# EAGLE schematic EEZ PSU power board r5B6b (EAGLE 6.1)
Assembly variants: Farnell, TME

## Sheet 1 of 5
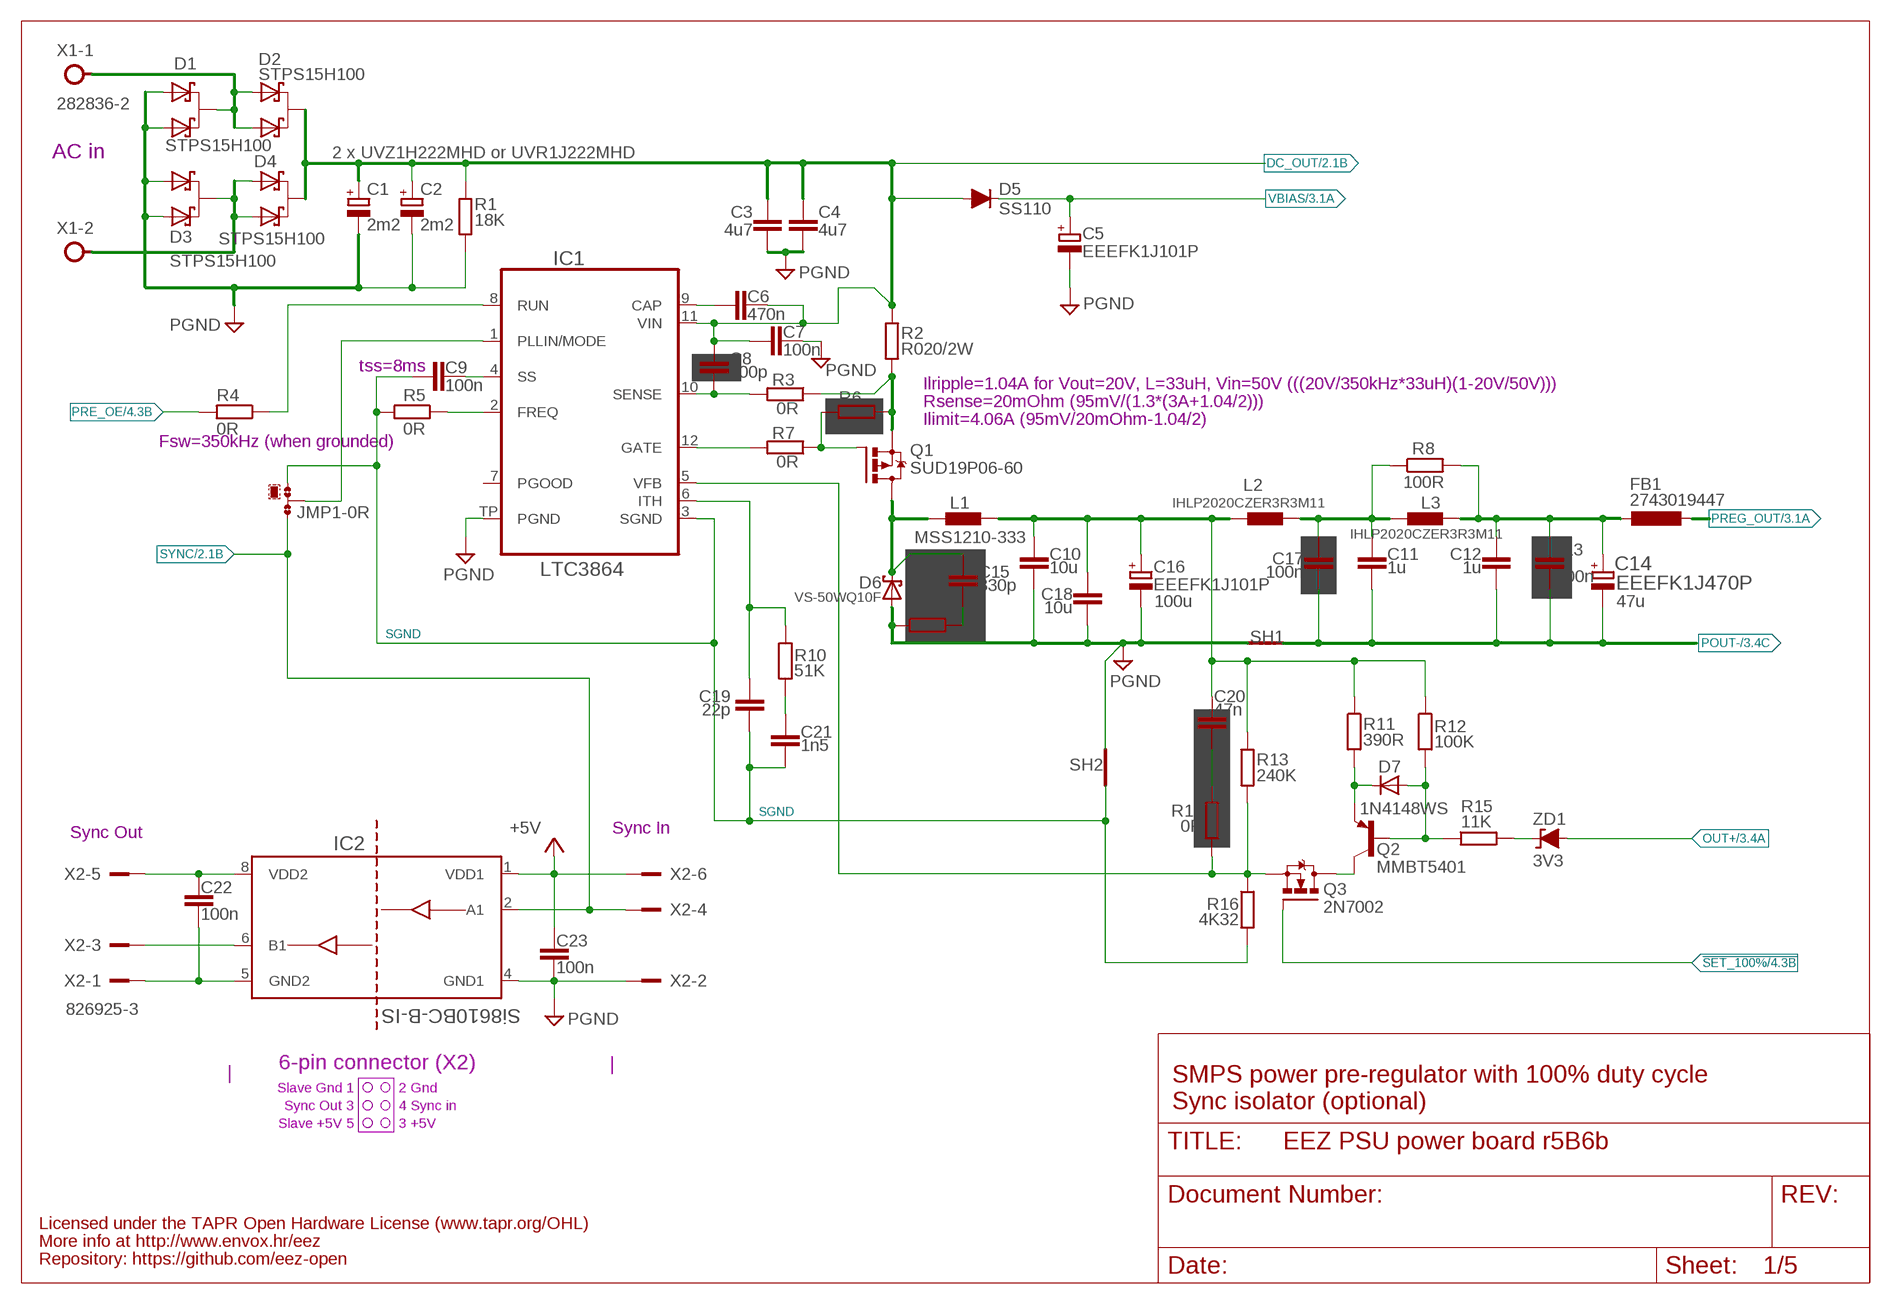
[diagram p0: schematic, sheet 1]

### Parts
C1  2m2  ECAP7.5G_18MM  [ECAP7.5/18]
C2  2m2  ECAP7.5G_18MM  [ECAP7.5/18]
C3  4u7  C-EUC1210  [C1210]
C4  4u7  C-EUC1210  [C1210]
C5  EEEFK1J101P  ECAP5G_10.5MM_F  [ECAP5/10.5+PANASONIC_F]
C6  470n  C-EUC0805  [C0805]
C7  100n  C-EUC0805  [C0805]
C8  100p  C-EUC0805  [C0805]
C9  100n  C-EUC0805  [C0805]
C10  10u  C-EUC1210  [C1210]
C11  1u  C-EUC1206  [C1206]
C12  1u  C-EUC1206  [C1206]
C13  100n  C-EUC0805  [C0805]
C14  EEEFK1J470P  EEE-FK1J470P-CASE-F  [CAPAE830X1050N]
C15  330p  C-EUC0805  [C0805]
C16  EEEFK1J101P  ECAP5G_10.5MM_F  [ECAP5/10.5+PANASONIC_F]
C17  100n  C-EUC0805  [C0805]
C18  10u  C-EUC1210  [C1210]
C19  22p  C-EUC0805  [C0805]
C20  47n  C-EUC0805  [C0805]
C21  1n5  C-EUC0805  [C0805]
C22  100n  C-EUC0603  [C0603]
C23  100n  C-EUC0603  [C0603]
D1  STPS15H100  VS-6CWQ06FNPBF  [TO252@1]
D2  STPS15H100  VS-6CWQ06FNPBF  [TO252@1]
D3  STPS15H100  VS-6CWQ06FNPBF  [TO252@1]
D4  STPS15H100  VS-6CWQ06FNPBF  [TO252@1]
D5  SS110  DIODEDO214AA  [DO214AA]
D6  VS-50WQ10F  SCHOTTKYTO252  [TO252@1]
D7  1N4148WS  DIODE-SOD323-W  [SOD323-W]
FB1  2743019447  L-EUL1812  [L1812]
IC1  LTC3864  [LTC_05-08-1666]
IC2  Si8610BC-B-IS  SI8610  [SOIC127P600X173-8N]
JMP1  0R-JUMPA  [A0R-JMP]
L1  MSS1210-333  COILCRAFT_MSS1210  [MSS1210]
L2  IHLP2020CZER3R3M11  IHLP-2020BZ-11  [IHLP-2020BZ-11]
L3  IHLP2020CZER3R3M11  IHLP-2020BZ-11  [IHLP-2020BZ-11]
Q1  SUD19P06-60  P-MOSFETDPAK  [TO229P990X239-3N]
Q2  MMBT5401  BC857B-PNP-SOT23-BEC  [SOT23-BEC]
Q3  2N7002  [SOT103P240X110-3N]
R1  18K  R-EU_R1206  [R1206]
R2  R020/2W  R-EU_R2512  [R2512]
R3  0R  R-EU_R0805  [R0805]
R4  0R  R-EU_R0805  [R0805]
R5  0R  R-EU_R0805  [R0805]
R6  100K  R-EU_R0805  [R0805]
R7  0R  R-EU_R0805  [R0805]
R8  100R  R-EU_R0805  [R0805]
R9  10R  R-EU_R1206  [R1206]
R10  51K  R-EU_R0805  [R0805]
R11  390R  R-EU_R0805  [R0805]
R12  100K  R-EU_R0805  [R0805]
R13  240K  R-EU_R0805  [R0805]
R14  0R  R-EU_R0805  [R0805]
R15  11K  R-EU_R0805  [R0805]
R16  4K32  R-EU_R0805  [R0805]
SH1  Pgnd to Pout- short  SHORT  [SHORT]
SH2  Sgnd to Pgnd short  SHORT  [SHORT]
X1  282836-2  TBLOCK5.0_2A  [TBLOCK5.0_2]
X2  826925-3  TSW-103-07-F-D  [TSW-103-07-F-D]
ZD1  3V3  ZENER-DIODEMINIMELF  [MINIMELF]

### Nets
!SET_100%: Q3.1(G) ; also sheet 4
+5V: C23.1 IC2.1(VDD1) X2.6 ; also sheet 2,3,4,5
AC_IN1: D3.3(C) D4.1(A1) D4.2(A2) X1.2
AC_IN2: D1.3(C) D2.1(A1) D2.2(A2) X1.1
DC_OUT: C1.+ C2.+ C3.1 C4.1 C6.2 C7.1 C8.1 D2.3(C) D4.3(C) D5.A IC1.11(VIN) R1.1 R2.1 ; also sheet 2
FB: IC1.5(VFB) Q3.2(S) R13.2 R14.1 R16.1
GND [gnd]: C1.- C2.- C3.2 C4.2 C5.- C5.-.1(-) C7.2 C10.2 C16.- C16.-.1(-) C18.2 C23.2 D1.1(A1) D1.2(A2) D3.1(A1) D3.2(A2) D6.1(A) D6.2(A) IC1.TP(PGND) IC2.4(GND1) R1.2 R9.1 SH1.2(GND_B) SH2.2(GND_B) X2.2 ; supply symbol labelled PGND ; also sheet 2,3,4,5
ISO_GND: C22.2 IC2.5(GND2) X2.1
L_OUT: C10.1 C16.+ C16.+.1(+) C18.1 C20.1 L1.2 L2.1 R11.1 R12.1 R13.1
MODE: IC1.1(PLLIN/MODE) JMP1.2
N$7: C20.2 R14.2
N$19: D7.C Q2.E R11.2
N$20: C19.1 IC1.6(ITH) R10.2
N$21: C21.1 R10.1
N$23: C6.1 IC1.9(CAP)
N$24: C8.2 IC1.10(SENSE) R3.2
N$25: R15.2 ZD1.C
N$28: IC1.12(GATE) R7.2
N$30: Q1.1(G) R6.1 R7.1
N$31: IC1.2(FREQ) R5.1
N$33: C9.2 IC1.4(SS)
N$34: Q2.C Q3.3(D)
N$35: C11.1 C17.2 L2.2 L3.1 R8.1
N$36: IC1.8(RUN) R4.1
N$38: C15.2 R9.2
N$79: D7.A Q2.B R12.2 R15.1
N$127: IC2.6(B1) X2.3
N$193: C22.1 IC2.8(VDD2) X2.5
OUT+: ZD1.A ; also sheet 3
P_OUT: C12.1 C13.1 C14.1 FB1.1 L3.2 R8.2
POUT-: C11.2 C12.2 C13.2 C14.2 C17.1 SH1.1(GND_A) ; also sheet 3
PRE_OE: R4.2 ; also sheet 4
PREG_OUT: FB1.2 ; also sheet 3
SENSE: Q1.3(S) R2.2 R3.1 R6.2
SGND: C9.1 C19.2 C21.2 IC1.3(SGND) JMP1.1 R5.2 R16.2 SH2.1(GND_A)
SW: C15.1 D6.3(C) L1.1 Q1.2(D)
SYNC: IC2.2(A1) JMP1.3 X2.4 ; also sheet 2
VBIAS: C5.+ C5.+.1(+) D5.C ; also sheet 3
Unconnected: IC1.7(PGOOD)

### Notes on the sheet
- AC in | 2 x UVZ1H222MHD or UVR1J222MHD
- tss=8ms
- Ilripple=1.04A for Vout=20V, L=33uH, Vin=50V (((20V/350kHz*33uH)(1-20V/50V)))
- Rsense=20mOhm (95mV/(1.3*(3A+1.04/2)))
- Ilimit=4.06A (95mV/20mOhm-1.04/2)
- Fsw=350kHz (when grounded)
- 100u | 47u
- Sync Out | Sync In
- 6-pin connector (X2)
- Slave Gnd 1 | 2 Gnd | SMPS power pre-regulator with 100% duty cycle
- Sync Out 3 | 4 Sync in
- Sync isolator (optional)
- Slave +5V 5 | 3 +5V
- Licensed under the TAPR Open Hardware License (www.tapr.org/OHL)
- More info at http://www.envox.hr/eez
- Repository: https://github.com/eez-open

## Sheet 2 of 5
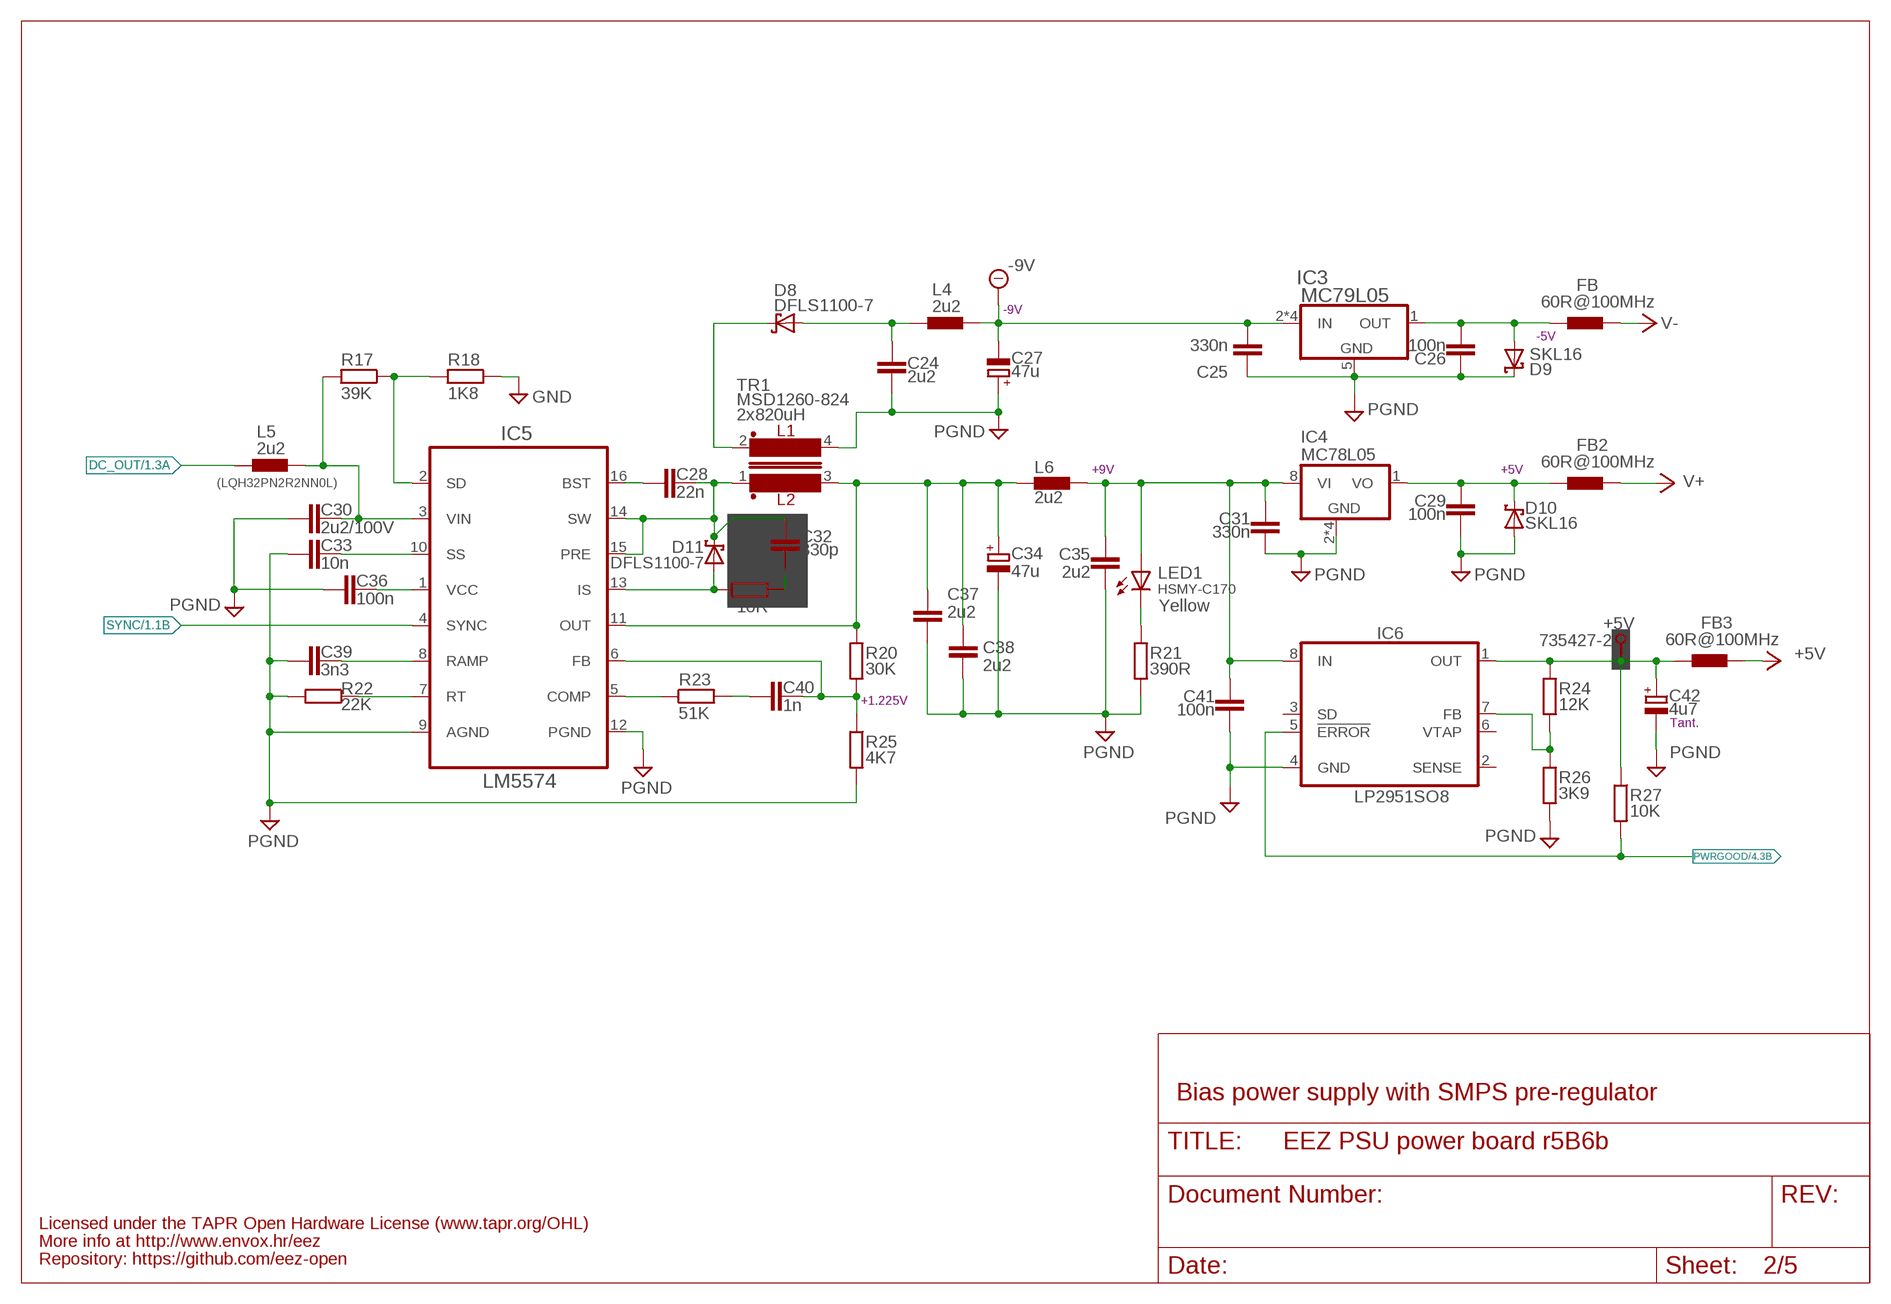
[diagram p1: schematic, sheet 2]

### Parts
+5V  735427-2  PCB_TEST_TABSHIELD  [PCB_SHIELD_TAB]
C24  2u2  C-EUC0805  [C0805]
C25  330n  C-EUC0805  [C0805]
C26  100n  C-EUC0805  [C0805]
C27  47u  ECAPPANASONIC_H  [CAPAE660X610N]
C28  22n  C-EUC0805  [C0805]
C29  100n  C-EUC0805  [C0805]
C30  2u2/100V  C-EUC1210  [C1210]
C31  330n  C-EUC0805  [C0805]
C32  330p  C-EUC0805  [C0805]
C33  10n  C-EUC0805  [C0805]
C34  47u  ECAPPANASONIC_H  [CAPAE660X610N]
C35  2u2  C-EUC0805  [C0805]  (variant Farnell: 2320829)  (variant TME: CL21B225KAFNNNG )
C36  100n  C-EUC0805  [C0805]
C37  2u2  C-EUC0805  [C0805]  (variant Farnell: 2320829)  (variant TME: CL21B225KAFNNNG )
C38  2u2  C-EUC0805  [C0805]  (variant Farnell: 2320829)  (variant TME: CL21B225KAFNNNG )
C39  3n3  C-EUC0805  [C0805]
C40  1n  C-EUC0805  [C0805]
C41  100n  C-EUC0805  [C0805]
C42  4u7  ECAP1206  [EC1206]
D8  DFLS1100-7  SCHOTTKYSOD123  [SOD123]
D9  SKL16  SCHOTTKYSOD123  [SOD123]
D10  SKL16  SCHOTTKYSOD123  [SOD123]
D11  DFLS1100-7  SCHOTTKYSOD123  [SOD123]
FB  60R@100MHz  FERRITE_BEAD0603  [BEAD0603]
FB2  60R@100MHz  FERRITE_BEAD0603  [BEAD0603]
FB3  60R@100MHz  FERRITE_BEAD0603  [BEAD0603]
IC3  MC79L05  MC79LXXSOIC  [SOIC127P600X173-8N]
IC4  MC78L05  MC78LXXSOIC8  [SOIC127P600X173-8N]
IC5  LM5574  [SOP65P640X110-16N]
IC6  LP2951SO8  [SOIC127P600X175-8N]
L4  2u2  L1210  [L1210]
L5  2u2  L1210  [L1210]
L6  2u2  L1210  [L1210]
LED1  HSMY-C170  LEDCHIPLED_0805  [CHIPLED_0805]
R17  39K  R-EU_R0805  [R0805]
R18  1K8  R-EU_R0805  [R0805]
R19  10R  R-EU_R1206  [R1206]
R20  30K  R-EU_R0805  [R0805]
R21  390R  R-EU_R0805  [R0805]
R22  22K  R-EU_R0805  [R0805]
R23  51K  R-EU_R0805  [R0805]
R24  12K  R-EU_R0805  [R0805]
R25  4K7  R-EU_R0805  [R0805]
R26  3K9  R-EU_R0805  [R0805]
R27  10K  R-EU_R0805  [R0805]
TR1  MSD1260-824  COILCRAFT_MSD1260INV  [MSD1260]

### Nets
+5V: FB3.P$2 ; also sheet 1,3,4,5
+VNR: C31.1 C35.1 C41.1 IC4.8(VI) IC6.8(IN) L6.2 LED1.A
-9V: C25.2 C27.2(-) IC3.2(IN) IC3.3(IN) IC3.6(IN) IC3.7(IN) L4.2 ; also sheet 3
DC_OUT: L5.1 ; also sheet 1
DC_PREG1: C30.1 IC5.3(VIN) L5.2 R17.2
GND [gnd]: C24.2 C25.1 C26.1 C27.1(+) C29.2 C30.2 C31.2 C33.2 C34.2(-) C35.2 C36.1 C37.2 C38.2 C39.1 C41.2 C42.- D9.C D10.A IC3.5(GND) IC4.2(GND) IC4.3(GND) IC4.6(GND) IC4.7(GND) IC5.9(AGND) IC5.12(PGND) IC6.4(GND) R18.1 R21.2 R22.2 R25.2 R26.2 TR1.4 ; supply symbol labelled PGND ; also sheet 1,3,4,5
IS: D11.A IC5.13(IS) R19.1
N$4: C26.2 D9.A FB.P$1 IC3.1(OUT)
N$5: C29.1 D10.C FB2.P$1 IC4.1(VO)
N$41: +5V.1 C42.+ FB3.P$1 IC6.1(OUT) R24.1 R27.1
N$43: LED1.C R21.1
N$46: C32.2 R19.2
N$64: IC6.7(FB) R24.2 R26.1
N$77: C40.2 R23.2
N$128: C40.1 IC5.6(FB) R20.2 R25.1
N$131: C28.2 IC5.16(BST)
N$135: IC5.5(COMP) R23.1
N$165: IC5.7(RT) R22.1
N$166: C36.2 IC5.1(VCC)
N$167: C39.2 IC5.8(RAMP)
N$168: C33.1 IC5.10(SS)
N$179: C24.1 D8.A L4.1
N$180: IC5.2(SD) R17.1 R18.2
PWRGOOD: IC6.5(!ERROR) R27.2 ; also sheet 4
SW1: C28.1 C32.1 D11.C IC5.14(SW) IC5.15(PRE) TR1.1
SYNC: IC5.4(SYNC) ; also sheet 1
V+: FB2.P$2 ; also sheet 3,5
V-: FB.P$2 ; also sheet 3,5
VOUT+: C34.1(+) C37.1 C38.1 IC5.11(OUT) L6.1 R20.1 TR1.3
VOUT-: D8.C TR1.2
Unconnected: IC6.2(SENSE) IC6.3(SD) IC6.6(VTAP)

### Notes on the sheet
- -9V
- -5V
- 2x820uH
- +9V | +5V
- (LQH32PN2R2NN0L)
- Yellow
- +1.225V
- Tant.
- Bias power supply with SMPS pre-regulator
- Licensed under the TAPR Open Hardware License (www.tapr.org/OHL)
- More info at http://www.envox.hr/eez
- Repository: https://github.com/eez-open

## Sheet 3 of 5
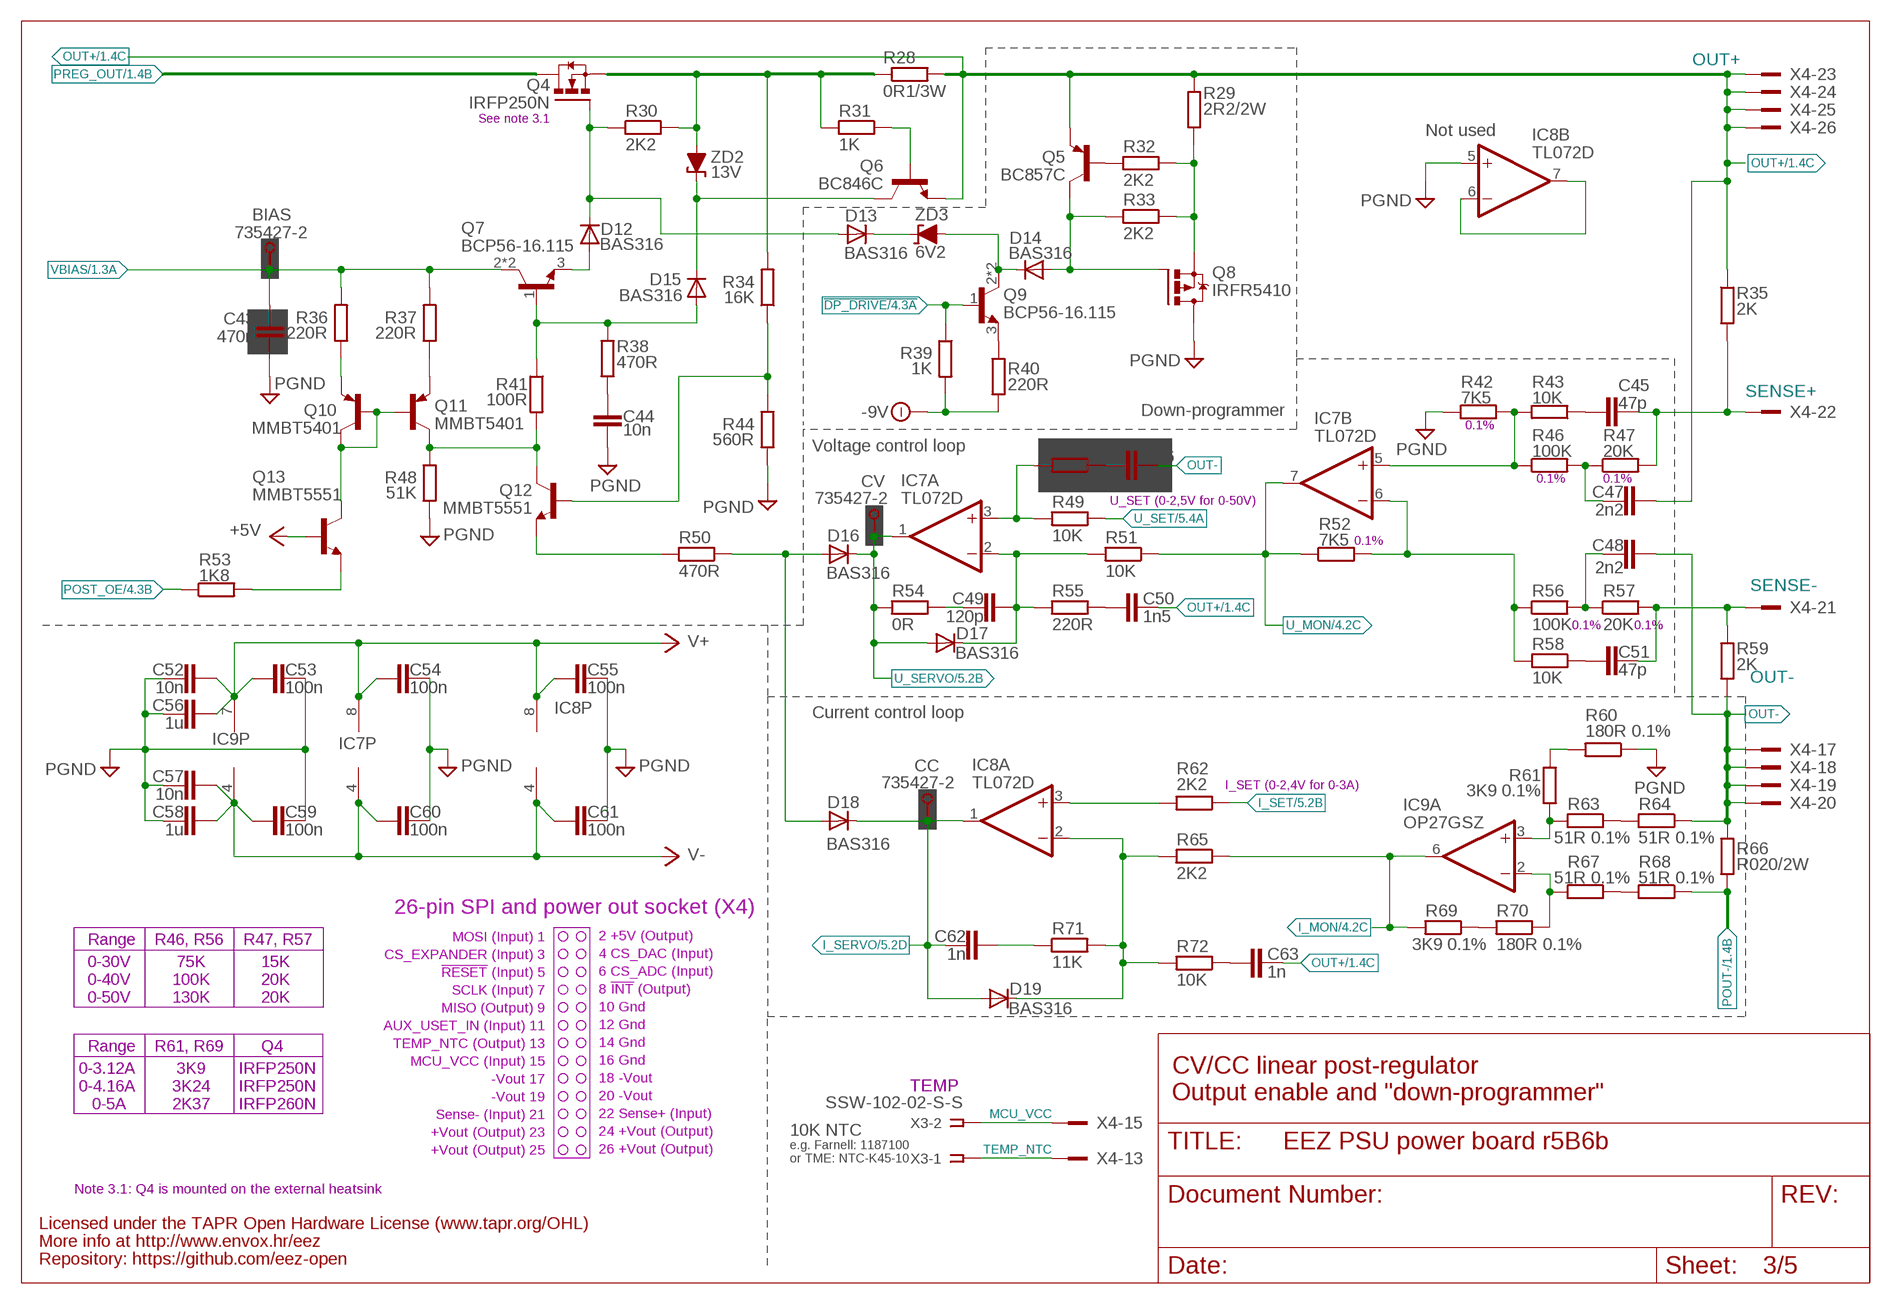
[diagram p2: schematic, sheet 3]

### Parts
BIAS  735427-2  PCB_TEST_TABSHIELD  [PCB_SHIELD_TAB]
C43  470n  C-EUC1812  [C1812]
C44  10n  C-EUC0805  [C0805]
C45  47p  C-EUC0805  [C0805]
C46  1n5  C-EUC0805  [C0805]
C47  2n2  C-EUC0805  [C0805]
C48  2n2  C-EUC0805  [C0805]
C49  120p  C-EUC0805  [C0805]
C50  1n5  C-EUC0805  [C0805]
C51  47p  C-EUC0805  [C0805]
C52  10n  C-EUC0805  [C0805]
C53  100n  C-EUC0603  [C0603]
C54  100n  C-EUC0603  [C0603]
C55  100n  C-EUC0603  [C0603]
C56  1u  C-EUC0805  [C0805]
C57  10n  C-EUC0805  [C0805]
C58  1u  C-EUC0805  [C0805]
C59  100n  C-EUC0603  [C0603]
C60  100n  C-EUC0603  [C0603]
C61  100n  C-EUC0603  [C0603]
C62  1n  C-EUC0805  [C0805]
C63  1n  C-EUC0805  [C0805]
CC  735427-2  PCB_TEST_TABSHIELD  [PCB_SHIELD_TAB]
CV  735427-2  PCB_TEST_TABSHIELD  [PCB_SHIELD_TAB]
D12  BAS316  DIODE-SOD323-W  [SOD323-W]
D13  BAS316  DIODE-SOD323-W  [SOD323-W]
D14  BAS316  DIODE-SOD323-W  [SOD323-W]
D15  BAS316  DIODE-SOD323-W  [SOD323-W]
D16  BAS316  DIODE-SOD323-W  [SOD323-W]
D17  BAS316  DIODE-SOD323-W  [SOD323-W]
D18  BAS316  DIODE-SOD323-W  [SOD323-W]
D19  BAS316  DIODE-SOD323-W  [SOD323-W]
IC7  TL072D  TL072SOIC8  [SOIC127P600X173-8N]
IC8  TL072D  TL072SOIC8  [SOIC127P600X173-8N]
IC9  OP27GSZ  OP27GSZSO8  [SOIC127P600X173-8N]
Q4  IRFP250N  IRFP240BOTTOM  [TO247BH-CLR]
Q5  BC857C  BC857C-PNP-SOT23-BEC  [SOT23-BEC]
Q6  BC846C  BC846B-NPN-SOT23-BEC  [SOT23-BEC]
Q7  BCP56-16.115  BCP56  [SOT230P700X180-4N]
Q8  IRFR5410  P-MOSFETDPAK  [TO229P990X239-3N]
Q9  BCP56-16.115  BCP56  [SOT230P700X180-4N]
Q10  MMBT5401  BC857B-PNP-SOT23-BEC  [SOT23-BEC]
Q11  MMBT5401  BC857B-PNP-SOT23-BEC  [SOT23-BEC]
Q12  MMBT5551  MMBT5551LT1-NPN-SOT23-BEC  [SOT23-BEC]
Q13  MMBT5551  MMBT5551LT1-NPN-SOT23-BEC  [SOT23-BEC]
R28  0R1/3W  R_EUCOMBO  [R_2512+0411/15]
R29  2R2/2W  R_EUCOMBO  [R_2512+0411/15]
R30  2K2  R-EU_R0805  [R0805]
R31  1K  R-EU_R0805  [R0805]
R32  2K2  R-EU_R0805  [R0805]
R33  2K2  R-EU_R0805  [R0805]
R34  16K  R-EU_R0805  [R0805]
R35  2K  R-EU_R0805  [R0805]
R36  220R  R-EU_R0805  [R0805]
R37  220R  R-EU_R0805  [R0805]
R38  470R  R-EU_R0805  [R0805]
R39  1K  R-EU_R0805  [R0805]
R40  220R  R-EU_R0805  [R0805]
R41  100R  R-EU_R0805  [R0805]
R42  7K5  R-EU_R0805  [R0805]
R43  10K  R-EU_R0805  [R0805]
R44  560R  R-EU_R0805  [R0805]
R45  220R  R-EU_R0805  [R0805]
R46  100K  R-EU_R0805  [R0805]
R47  20K  R-EU_R0805  [R0805]
R48  51K  R-EU_R0805  [R0805]
R49  10K  R-EU_R0805  [R0805]
R50  470R  R-EU_R0805  [R0805]
R51  10K  R-EU_R0805  [R0805]
R52  7K5  R-EU_R0805  [R0805]
R53  1K8  R-EU_R0805  [R0805]
R54  0R  R-EU_R0805  [R0805]
R55  220R  R-EU_R0805  [R0805]
R56  100K  R-EU_R0805  [R0805]
R57  20K  R-EU_R0805  [R0805]
R58  10K  R-EU_R0805  [R0805]
R59  2K  R-EU_R0805  [R0805]
R60  180R 0.1%  R-EU_R0805  [R0805]
R61  3K9 0.1%  R-EU_R0805  [R0805]
R62  2K2  R-EU_R0805  [R0805]
R63  51R 0.1%  R-EU_R0805  [R0805]
R64  51R 0.1%  R-EU_R0805  [R0805]
R65  2K2  R-EU_R0805  [R0805]
R66  R020/2W  R-EU_R2512  [R2512]
R67  51R 0.1%  R-EU_R0805  [R0805]
R68  51R 0.1%  R-EU_R0805  [R0805]
R69  3K9 0.1%  R-EU_R0805  [R0805]
R70  180R 0.1%  R-EU_R0805  [R0805]
R71  11K  R-EU_R0805  [R0805]
R72  10K  R-EU_R0805  [R0805]
X3  SSW-102-02-S-S  [SSW-102-02-S-S]
X4  SSW-113-02-T-D-RA  [SSW-113-02-T-D-RA]
ZD2  13V  ZENER-DIODEMINIMELF  [MINIMELF]
ZD3  6V2  ZENER-DIODEMINIMELF  [MINIMELF]

### Nets
!DP_DRIVE: Q9.1(B) R39.1 ; also sheet 4
+5V: Q13.B ; also sheet 1,2,4,5
-9V: R39.2 R40.2 ; also sheet 2
GND [gnd]: C43.2 C44.2 C52.1 C53.2 C54.1 C55.1 C56.1 C57.1 C58.1 C59.2 C60.1 C61.1 IC8.5(B:+IN) Q8.2(D) R42.1 R44.1 R48.1 R60.1 ; supply symbol labelled PGND ; also sheet 1,2,4,5
I_MON: IC9.6(A:OUT) R65.1 R69.2 ; also sheet 4
I_SERVO: C62.2 CC.1 D18.C D19.A IC8.1(A:OUT) ; also sheet 5
I_SET: R62.1 ; also sheet 5
ISENSE+: IC9.3(A:+IN) R61.2 R63.2
ISENSE-: IC9.2(A:-IN) R67.2 R70.1
MCU_VCC: X3.2 X4.15
N$1: Q9.3(E) R40.1
N$2: Q5.B R32.2
N$3: C45.2 R43.1
N$8: R63.1 R64.2
N$10: C51.2 R58.1
N$13: R67.1 R68.2
N$14: R69.1 R70.2
N$15: R60.2 R61.1
N$16: IC8.6(B:-IN) IC8.7(B:OUT)
N$17: C48.1 R56.2 R57.1
N$18: C49.2 R54.1
N$22: C63.2 R72.1
N$26: C46.2 R45.1
N$27: C50.2 R55.1
N$29: IC7.3(A:+IN) R45.2 R49.2
N$32: C49.1 D17.C IC7.2(A:-IN) R51.2 R55.2
N$37: D19.C IC8.2(A:-IN) R65.2 R71.2 R72.2
N$44: Q12.B R34.1 R44.2
N$50: IC8.3(A:+IN) R62.2
N$54: D16.A D18.A R50.1
N$56: D12.C D13.A Q4.G R30.1
N$62: D12.A Q7.3(E)
N$65: D15.A Q7.1(B) R38.2 R41.1
N$67: C44.1 R38.1
N$117: C47.1 R46.2 R47.1
N$129: D15.C Q6.C ZD2.C
N$143: D13.C ZD3.C
N$145: Q12.E R50.2
N$146: Q8.3(S) R29.1 R29.1.1 R32.1 R33.1
N$147: D14.A Q5.C Q8.1(G) R33.2
N$150: IC7.5(B:+IN) R42.2 R43.2 R46.1
N$158: IC7.6(B:-IN) R52.2 R56.1 R58.2
N$172: C62.1 R71.1
N$183: Q11.E R37.1
N$184: Q10.E R36.1
N$186: Q13.E R53.2
N$201: Q6.B R31.1
OUT+: C47.2 C50.1 C63.1 Q5.E Q6.E R28.2 R28.2.1 R29.2 R29.2.1 R35.1 X4.23 X4.24 X4.25 X4.26 ; also sheet 1
OUT-: C46.1 C48.2 R59.2 R64.1 R66.1 X4.17 X4.18 X4.19 X4.20
POST_OE: R53.1 ; also sheet 4
POUT-: R66.2 R68.1 ; also sheet 1
PREG_OUT: Q4.D ; also sheet 1
Q4_OUT: Q4.S R28.1 R28.1.1 R30.2 R31.2 R34.2 ZD2.A
Q7C: Q10.B Q10.C Q11.B Q13.C
Q9C: D14.C Q9.2(C) Q9.4(C) ZD3.A
Q11C: Q11.C Q12.C R41.2 R48.2
SENSE+: C45.1 R35.2 R47.2 X4.22
SENSE-: C51.1 R57.2 R59.1 X4.21
TEMP_NTC: X3.1 X4.13
U_MON: IC7.7(B:OUT) R51.1 R52.1 ; also sheet 4
U_SERVO: CV.1 D16.C D17.A IC7.1(A:OUT) R54.2 ; also sheet 5
U_SET: R49.1 ; also sheet 5
V+: C52.2 C53.1 C54.2 C55.2 C56.2 IC7.8(P:V+) IC8.8(P:V+) IC9.7(P:V+) ; also sheet 2,5
V-: C57.2 C58.2 C59.1 C60.2 C61.2 IC7.4(P:V-) IC8.4(P:V-) IC9.4(P:V-) ; also sheet 2,5
VBIAS: BIAS.1 C43.1 Q7.2(C) Q7.4(C) R36.2 R37.2 ; also sheet 1

### Notes on the sheet
- See note 3.1
- Not used
- Down-programmer
- 0.1%
- Voltage control loop
- 0.1% | 0.1%
- U_SET (0-2,5V for 0-50V)
- 0.1%
- 0.1% | 0.1%
- Current control loop
- I_SET (0-2,4V for 0-3A)
- 26-pin SPI and power out socket (X4)
- MOSI (Input) 1
- 2 +5V (Output)
- Range | R46, R56 | R47, R57
- CS_EXPANDER (Input) 3
- 4 CS_DAC (Input)
- 0-30V | 75K | 15K | !RESET! (Input) 5
- 6 CS_ADC (Input)
- 0-40V | 100K | 20K | SCLK (Input) 7
- 8 !INT! (Output)
- 0-50V | 130K | 20K | MISO (Output) 9
- 10 Gnd
- AUX_USET_IN (Input) 11
- 12 Gnd
- TEMP_NTC (Output) 13
- 14 Gnd
- Range | R61, R69 | Q4
- MCU_VCC (Input) 15
- 16 Gnd
- 0-3.12A | 3K9 | IRFP250N | -Vout 17 | CV/CC linear post-regulator
- 18 -Vout
- 0-4.16A | 3K24 | IRFP250N | -Vout 19 | TEMP
- 20 -Vout | Output enable and "down-programmer"
- 0-5A | 2K37 | IRFP260N | Sense- (Input) 21
- 22 Sense+ (Input)
- +Vout (Output) 23
- 24 +Vout (Output) | 10K NTC
- +Vout (Output) 25
- e.g. Farnell: 1187100
- 26 +Vout (Output)
- or TME: NTC-K45-10
- Note 3.1: Q4 is mounted on the external heatsink
- Licensed under the TAPR Open Hardware License (www.tapr.org/OHL)
- More info at http://www.envox.hr/eez
- Repository: https://github.com/eez-open

## Sheet 4 of 5
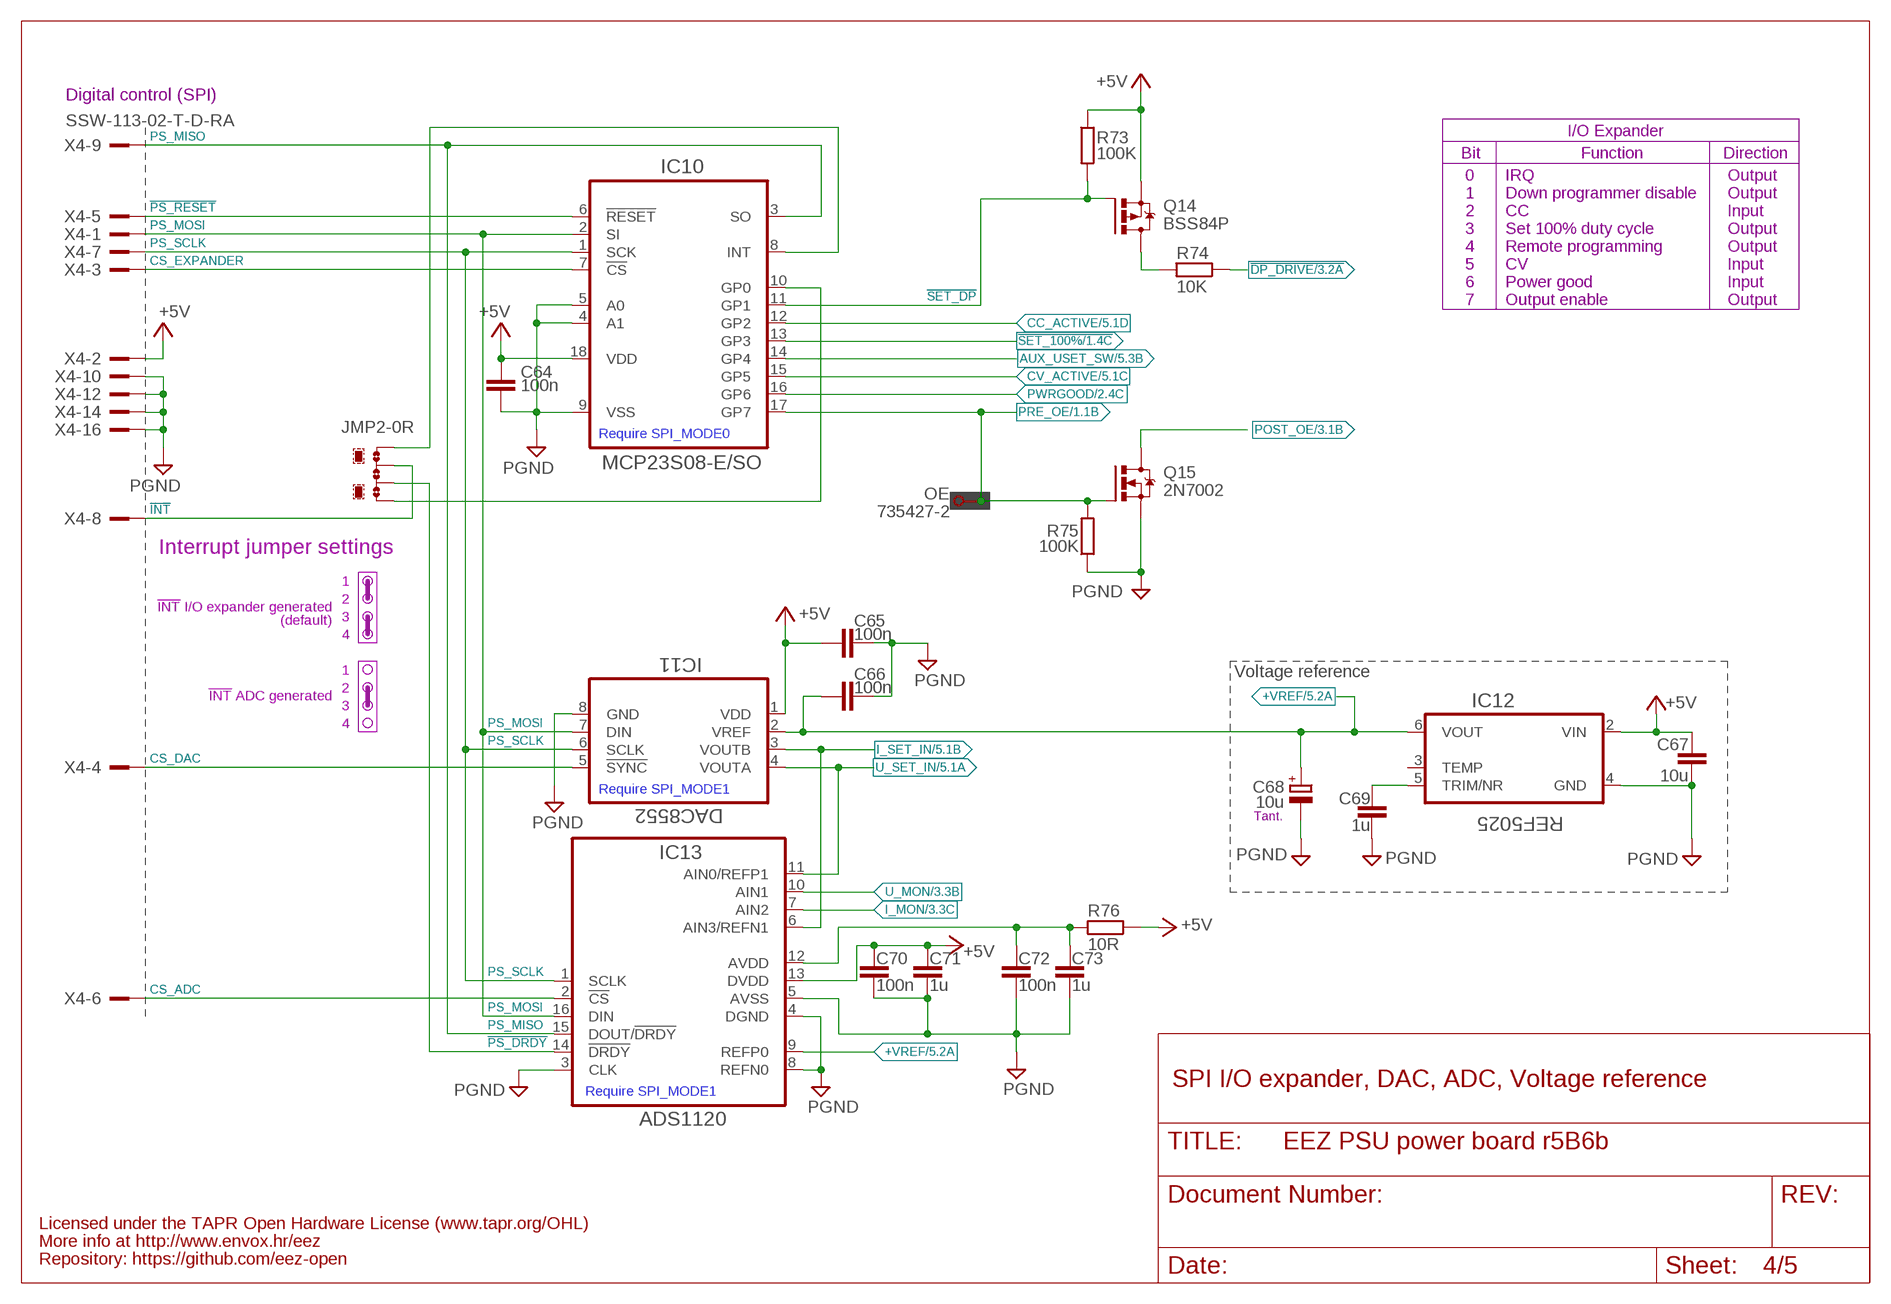
[diagram p3: schematic, sheet 4]

### Parts
C64  100n  C-EUC0603  [C0603]
C65  100n  C-EUC0603  [C0603]
C66  100n  C-EUC0603  [C0603]
C67  10u  C-EUC1206  [C1206]
C68  10u  ECAP1206  [EC1206]
C69  1u  C-EUC0805  [C0805]
C70  100n  C-EUC0603  [C0603]
C71  1u  C-EUC0805  [C0805]
C72  100n  C-EUC0603  [C0603]
C73  1u  C-EUC0805  [C0805]
IC10  MCP23S08-E/SO  MCP23S08  [SOIC127P1030X265-18N]
IC11  DAC8552  DAC8552_DGK_8M  [DGK8-M]
IC12  REF5025  REF50XX  [SOIC127P600X175-8N]
IC13  ADS1120  ADS1120TSSOP-16  [PW(R-PDSO-G16)]
JMP2  0R-JMP41-2,3-4  [0R-JMP4]
OE  735427-2  PCB_TEST_TABSHIELD  [PCB_SHIELD_TAB]
Q14  BSS84P  IRLML2246TRPBF  [SOT95P237X112-3N]
Q15  2N7002  [SOT103P240X110-3N]
R73  100K  R-EU_R0805  [R0805]
R74  10K  R-EU_R0805  [R0805]
R75  100K  R-EU_R0805  [R0805]
R76  10R  R-EU_R0805  [R0805]

### Nets
!DP_DRIVE: R74.1 ; also sheet 3
!INT: JMP2.3 X4.8
!PS_DRDY: IC13.14(!DRDY) JMP2.2
!PS_RESET: IC10.6(!RESET) X4.5
!SET_100%: IC10.13(GP3) ; also sheet 1
!SET_DP: IC10.11(GP1) Q14.1(G) R73.2
+5V: C64.1 C65.2 C67.1 C70.2 C71.2 IC10.18(VDD) IC11.1(VDD) IC12.2(VIN) IC13.13(DVDD) Q14.2(S) R73.1 R76.1 X4.2 ; also sheet 1,2,3,5
+VREF: C66.2 C68.+ IC11.2(VREF) IC12.6(VOUT) IC13.9(REFP0) ; also sheet 5
AUX_USET_SW: IC10.14(GP4) ; also sheet 5
CC_ACTIVE: IC10.12(GP2) ; also sheet 5
CS_ADC: IC13.2(!CS) X4.6
CS_DAC: IC11.5(!SYNC) X4.4
CS_EXPANDER: IC10.7(!CS) X4.3
CV_ACTIVE: IC10.15(GP5) ; also sheet 5
DP_LED: Q14.3(D) R74.2
GND [gnd]: C64.2 C65.1 C66.1 C67.2 C68.- C69.2 C70.1 C71.1 C72.1 C73.1 IC10.4(A1) IC10.5(A0) IC10.9(VSS) IC11.8(GND) IC12.4(GND) IC13.3(CLK) IC13.4(DGND) IC13.5(AVSS) IC13.8(REFN0) Q15.2(S) R75.1 X4.10 X4.12 X4.14 X4.16 ; supply symbol labelled PGND ; also sheet 1,2,3,5
I_MON: IC13.7(AIN2) ; also sheet 3
I_SET_IN: IC11.3(VOUTB) IC13.6(AIN3/REFN1) ; also sheet 5
INT_EXP: IC10.8(INT) JMP2.4
N$11: C69.1 IC12.5(TRIM/NR)
N$42: C72.2 C73.2 IC13.12(AVDD) R76.2
N$63: IC10.10(GP0) JMP2.1
POST_OE: Q15.3(D) ; also sheet 3
PRE_OE: IC10.17(GP7) OE.1 Q15.1(G) R75.2 ; also sheet 1
PS_MISO: IC10.3(SO) IC13.15(DOUT/!DRDY) X4.9
PS_MOSI: IC10.2(SI) IC11.7(DIN) IC13.16(DIN) X4.1
PS_SCLK: IC10.1(SCK) IC11.6(SCLK) IC13.1(SCLK) X4.7
PWRGOOD: IC10.16(GP6) ; also sheet 2
U_MON: IC13.10(AIN1) ; also sheet 3
U_SET_IN: IC11.4(VOUTA) IC13.11(AIN0/REFP1) ; also sheet 5
Unconnected: IC12.3(TEMP)

### Notes on the sheet
- Digital control (SPI)
- I/O Expander
- Bit | Function | Direction
- 0 | IRQ | Output
- 1 | Down programmer disable | Output
- 2 | CC | Input
- 3 | Set 100% duty cycle | Output
- 4 | Remote programming | Output
- 5 | CV | Input
- 6 | Power good | Input
- 7 | Output enable | Output
- Require SPI_MODE0
- Interrupt jumper settings
- 1
- 2
- !INT! I/O expander generated | 3
- (default)
- 4
- 1 | Voltage reference
- 2
- !INT! ADC generated | 3
- 4
- Require SPI_MODE1
- Tant.
- SPI I/O expander, DAC, ADC, Voltage reference
- Require SPI_MODE1
- Licensed under the TAPR Open Hardware License (www.tapr.org/OHL)
- More info at http://www.envox.hr/eez
- Repository: https://github.com/eez-open

## Sheet 5 of 5
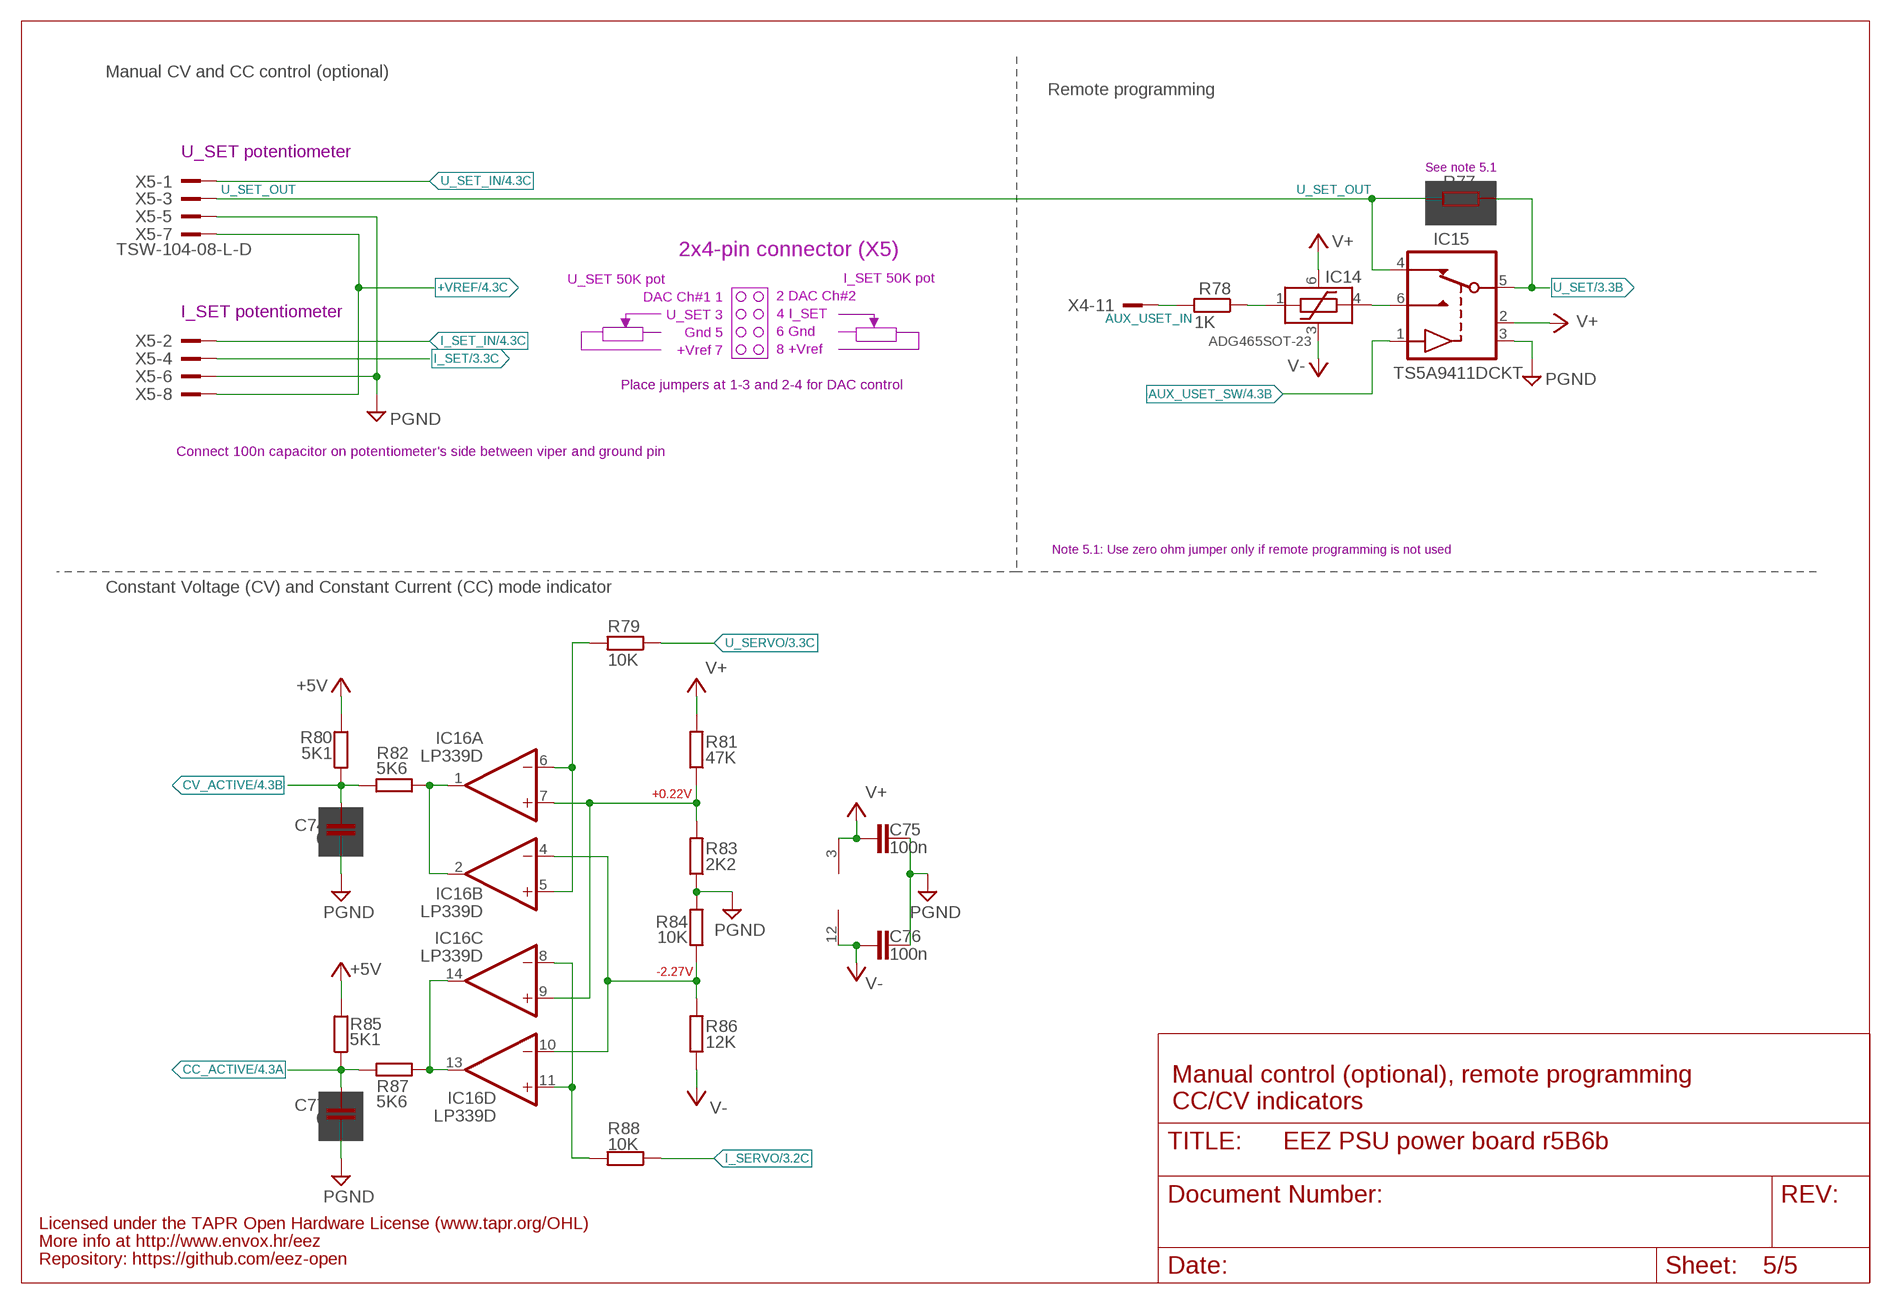
[diagram p4: schematic, sheet 5]

### Parts
C74  0  C-EUC0603  [C0603]
C75  100n  C-EUC0603  [C0603]
C76  100n  C-EUC0603  [C0603]
C77  0  C-EUC0603  [C0603]
IC14  ADG465SOT-23  [SOT95P280X145-6N]
IC15  TS5A9411DCKT  [SOT65P210X110-6N]
IC16  LP339D  LM339SO14  [SOIC127P600X175-14N]
R77  0R  R-EU_R0805  [R0805]
R78  1K  R-EU_R0805  [R0805]
R79  10K  R-EU_R0805  [R0805]
R80  5K1  R-EU_R0805  [R0805]
R81  47K  R-EU_R0805  [R0805]
R82  5K6  R-EU_R0805  [R0805]
R83  2K2  R-EU_R0805  [R0805]
R84  10K  R-EU_R0805  [R0805]
R85  5K1  R-EU_R0805  [R0805]
R86  12K  R-EU_R0805  [R0805]
R87  5K6  R-EU_R0805  [R0805]
R88  10K  R-EU_R0805  [R0805]
X5  TSW-104-08-L-D  TSW-104-02-S-D  [TSW-104-02-S-D]

### Nets
+5V: R80.2 R85.2 ; also sheet 1,2,3,4
+VREF: X5.7 X5.8 ; also sheet 4
AUX_USET_IN: R78.2 X4.11
AUX_USET_SW: IC15.1(IN) ; also sheet 4
CC_ACTIVE: C77.1 R85.1 R87.2 ; also sheet 4
CV_ACTIVE: C74.1 R80.1 R82.2 ; also sheet 4
GND [gnd]: C74.2 C75.1 C76.1 C77.2 IC15.3(GND) R83.1 R84.2 X5.5 X5.6 ; supply symbol labelled PGND ; also sheet 1,2,3,4
I_SERVO: R88.1 ; also sheet 3
I_SET: X5.4 ; also sheet 3
I_SET_IN: X5.2 ; also sheet 4
N$9: IC14.4(VS) IC15.6(S1)
N$12: IC14.1(VD) R78.1
N$45: IC16.1(A:OUT) IC16.2(B:OUT) R82.1
N$48: IC16.13(D:OUT) IC16.14(C:OUT) R87.1
N$153: IC16.5(B:+IN) IC16.6(A:-IN) R79.2
N$161: IC16.8(C:-IN) IC16.11(D:+IN) R88.2
N$170: IC16.7(A:+IN) IC16.9(C:+IN) R81.1 R83.2
N$177: IC16.4(B:-IN) IC16.10(D:-IN) R84.1 R86.2
U_SERVO: R79.1 ; also sheet 3
U_SET: IC15.5(D) R77.1 ; also sheet 3
U_SET_IN: X5.1 ; also sheet 4
U_SET_OUT: IC15.4(S2) R77.2 X5.3
V+: C75.2 IC14.6(VDD) IC15.2(VDD) IC16.3(P:V+) R81.2 ; also sheet 2,3
V-: C76.2 IC14.3(VSS) IC16.12(P:GND) R86.1 ; also sheet 2,3

### Notes on the sheet
- Manual CV and CC control (optional)
- Remote programming
- U_SET potentiometer
- See note 5.1
- 2x4-pin connector (X5)
- U_SET 50K pot
- I_SET 50K pot
- DAC Ch#1 1
- 2 DAC Ch#2
- I_SET potentiometer
- U_SET 3
- 4 I_SET
- Gnd 5
- 6 Gnd
- +Vref 7
- 8 +Vref
- Place jumpers at 1-3 and 2-4 for DAC control
- Connect 100n capacitor on potentiometer's side between viper and ground pin
- Note 5.1: Use zero ohm jumper only if remote programming is not used
- Constant Voltage (CV) and Constant Current (CC) mode indicator
- +0.22V
- -2.27V
- Manual control (optional), remote programming
- CC/CV indicators
- Licensed under the TAPR Open Hardware License (www.tapr.org/OHL)
- More info at http://www.envox.hr/eez
- Repository: https://github.com/eez-open

## Library data of the parts
+5V BIAS CC CV OE = EEZ_Lib1:PCB_TEST_TAB
C1 C2 C5 C16 C27 C34 C42 C68 = EEZ_Lib1:ECAP
C3 C4 C6-C10 C13 C15 C17-C26 C28-C33 C35-C41 C43-C67 C69-C77 = rcl:C-EU: CAPACITOR, European symbol
C11 C12 = resistor:C-EU: CAPACITOR, European symbol
C14 = Panasonic-EEEFK_EEEFP:EEE-: Aluminum Electrolytic Capacitors,Surface Mount Type; MPN: EEE-FK1J470P; OC_FARNELL: 9696032; OC_NEWARK: 96K9403; PACKAGE: CASE-F; SUPPLIER: PANASONIC; TOLERANCE: ±20 %; VALUE: 47UF; VOLTAGERATING: 63 V
D1-D4 = EEZ_Lib1:VS-6CWQ06FNPBF: Schottky Rectifier, 2 x 3.5 A
D5 = EEZ_Lib1:DIODE
D6 D8-D11 = EEZ_Lib1:SCHOTTKY
D7 D12-D19 = diode:DIODE-: DIODE
FB FB2 FB3 = EEZ_Lib1:FERRITE_BEAD: FAIR-RITE - 2506033007Y3 - FERRITE BEAD, 0.04OHM, 3A, 0603 Farnell: 2112873
FB1 = rcl:L-EU: INDUCTOR, European symbol
IC1 = EEZ_Lib1:LTC3864: 60V Low Iq Step-Down DC/DC Controller with 100% Duty Cycle Capability
IC2 = EEZ_Lib1:SI8610: Low power 1-ch digital isolator Farnell: 2423233, 2423234
IC3 = EEZ_Lib1:MC79LXX: 3-terminal negative voltage regulator, up to 100mA
IC4 = EEZ_Lib1:MC78LXX: μA78L00 series positive voltage regulators
IC5 = EEZ_Lib1:LM5574: Step-Down Switching Regulator; MPN: LM5574MT; OC_FARNELL: 1325419; OC_NEWARK: 32M1267; PACKAGE: TSSOP-16; SUPPLIER: National Semiconductors
IC6 = EEZ_Lib1:LP2951: LP2950-N/LP2951-N Series of Adjustable Micropower Voltage Regulators
IC7 IC8 = EEZ_Lib1:TL072
IC9 = EEZ_Lib1:OP27GSZ: Low Noise, Precision Operational Amplifier
IC10 = EEZ_Lib1:MCP23S08: 8-Bit I/O Expander with SPI; DESCRIPTION: IC I/O EXPANDER; MPN: MCP23S08-E/SO; OC_FARNELL: 1332092; OC_NEWARK: 08J8733; PACKAGE: SOIC-18; SUPPLIER: Microchip
IC11 = EEZ_Lib1:DAC8552_DGK_8
IC12 = EEZ_Lib1:REF50XX: Low-Noise (3μVpp/V), Very Low Drift (max. 8ppm/°C), Precision Voltage Reference Pin compatible with REF2 Farnell: 1439628
IC13 = EEZ_Lib1:ADS1120: Low-Power, Low-Noise, 16-Bit, Analog-to-Digital Converter for Small-Signal Sensors Farnell: 2402249
IC14 = EEZ_Lib1:ADG465: Single Channel Protector in an SOT-23 Package
IC15 = EEZ_Lib1:TS5A9411DCKT: 10-Ω SPDT ANALOG SWITCH SINGLE-CHANNEL 2:1 MULTIPLEXER/DEMULTIPLEXER; FARNELL: 1755582
IC16 = EEZ_Lib1:LM339: Low Power Low Offset Voltage Quad Comparators with open collector; LM139/LM239/LM339/LM2901/LM3302
JMP1 = jump-0r-smd:0R-JUMP: SMD 0R 0805 Jumper
JMP2 = EEZ_Lib1:0R-JMP4: SMD 0R 0805 jumper section (1-2, 3-4)
L1 = EEZ_Lib1:COILCRAFT_MSS1210: Shielded Power Inductors, 12.3 × 12.3 mm footprint; 10 mm high
L2 L3 = EEZ_Lib1:IHLP-2020BZ-11: Low Profile, High Current IHLP® Inductors
L4-L6 = EEZ_Lib1:L1210
LED1 = led:LED: LED OSRAM: - CHIPLED LG R971, LG N971, LY N971, LG Q971, LY Q971, LO R971, LY R971 LH N974, LH R974 LS Q976, LO Q976, LY Q976 LO Q996 - Hyper CHIPLED LW Q18S LB Q993, LB Q99A, LB R99A - SideLED LS A670, LO A670, LY A670, LG A670, LP A670 LB A673, LV A673, LT A673, LW A673 LH A674 LY A675 LS A676, LA A676, LO A676, LY A676, LW A676 LS A679, LY A679, LG A679 - Hyper Micro SIDELED® LS Y876, LA Y876, LO Y876, LY Y876 LT Y87S - SmartLED LW L88C, LW L88S LB L89C, LB L89S, LG L890 LS L89K, LO L89K, LY L89K LS L896, LA L896, LO L896, LY L896 - TOPLED LS T670, LO T670, LY T670, LG T670, LP T670 LSG T670, LSP T670, LSY T670, LOP T670, LYG T670 LG T671, LOG T671, LSG T671 LB T673, LV T673, LT T673, LW T673 LH T674 LS T676, LA T676, LO T676, LY T676, LB T676, LH T676, LSB T676, LW T676 LB T67C, LV T67C, LT T67C, LS T67K, LO T67K, LY T67K, LW E67C LS E67B, LA E67B, LO E67B, LY E67B, LB E67C, LV E67C, LT E67C LW T67C LS T679, LY T679, LG T679 LS T770, LO T770, LY T770, LG T770, LP T770 LB T773, LV T773, LT T773, LW T773 LH T774 LS E675, LA E675, LY E675, LS T675 LS T776, LA T776, LO T776, LY T776, LB T776 LHGB T686 LT T68C, LB T68C - Hyper Mini TOPLED® LB M676 - Mini TOPLED Santana® LG M470 LS M47K, LO M47K, LY M47K Source: http://www.osram.convergy.de LUXEON: - LUMILED® LXK2-PW12-R00, LXK2-PW12-S00, LXK2-PW14-U00, LXK2-PW14-V00 LXK2-PM12-R00, LXK2-PM12-S00, LXK2-PM14-U00 LXK2-PE12-Q00, LXK2-PE12-R00, LXK2-PE12-S00, LXK2-PE14-T00, LXK2-PE14-U00 LXK2-PB12-K00, LXK2-PB12-L00, LXK2-PB12-M00, LXK2-PB14-N00, LXK2-PB14-P00, LXK2-PB14-Q00 LXK2-PR12-L00, LXK2-PR12-M00, LXK2-PR14-Q00, LXK2-PR14-R00 LXK2-PD12-Q00, LXK2-PD12-R00, LXK2-PD12-S00 LXK2-PH12-R00, LXK2-PH12-S00 LXK2-PL12-P00, LXK2-PL12-Q00, LXK2-PL12-R00 Source: www.luxeon.com KINGBRIGHT: KA-3528ASYC Source: www.kingbright.com
Q1 Q8 = EEZ_Lib1:P-MOSFET: HEXFET Power MosFet Source: http://www.irf.com/
Q2 Q5 Q10 Q11 = transistor:*-PNP-: PNP Transistror
Q3 Q15 = EEZ_Lib1:2N7002: N-CHANNEL ENHANCEMENT MODE FIELD EFFECT TRANSISTOR; MPN: 2N7002-7-F; OC_FARNELL: 1713823; OC_NEWARK: 25R5679; PACKAGE: SOT-23-3; SUPPLIER: DIODES INC.
Q4 = EEZ_Lib1:IRFP240: HEXFET Power MosFet Source: http://www.irf.com/
Q6 Q12 Q13 = transistor:*-NPN-: NPN Transistror BF959 corrected 2008.03.06
Q7 Q9 = EEZ_Lib1:BCP56: Low power NPN Transistor, Vceo=80V, Ic=1A, SOT-223
Q14 = EEZ_Lib1:IRLML2246TRPBF: HEXFET Power MOSFET (-20V, -2.6A); MPN: IRLML2246TRPBF; OC_FARNELL: 1888166; OC_NEWARK: 40T7450; PACKAGE: SOT-3; SUPPLIER: International Rectifier; TME: IRLML2246TRPBF
R1-R27 R30-R88 = rcl:R-EU_: RESISTOR, European symbol
R28 R29 = EEZ_Lib1:R_EU: RESISTOR - European symbol
SH1 SH2 = EEZ_Lib1:SHORT
TR1 = EEZ_Lib1:COILCRAFT_MSD1260INV: Coilcraft Coupled Inductors MSD1260 (inverted pinouts)
X1 = EEZ_Lib1:TBLOCK5.0_2A
X2 = EEZ_Lib1:TSW-103-07-F-D: Samtec TSW-103-07-F-D Header, 2.54MM, THT, 6-way; FARNELL: 2025171
X3 = con-samtec:SSW-102-02-S-S: THROUGH-HOLE .025" SQ POST SOCKET Source: Samtec SSW.pdf; MPN: SSW-102-02-S-S; OC_FARNELL: unknown; OC_NEWARK: 11P9351
X4 = EEZ_Lib1:SSW-113-02-T-D-RA: Samtec SSW-113-02-T-D-RA Receptacle, 2.54MM, RA, 26-way; FARNELL: 1805583; TME: ZL263-26DG
X5 = EEZ_Lib1:TSW-104-02-S-D: THROUGH-HOLE .025" SQ POST HEADER Source: Samtec TSW.pdf
ZD1-ZD3 = EEZ_Lib1:ZENER-DIODE

## Net classes
0 default: width 0.254 mm, drill 0.584 mm, clearance 0.254 mm
1 dgnd: width 0.254 mm, drill 0.584 mm, clearance 0.254 mm
2 gnd: width 0.254 mm, drill 0.584 mm, clearance 0.254 mm